# EasyEDA Pro project DS3 CONTROLLER L.epro

# Schematic Schematic1
Create Date: 2026-04-05; Page Name: P1; Project Name: DSBOARD3Daughter; Schematic Name: Schematic1; Update Date: 2026-04-07; Company: EasyEDA.com; Page Size: A4; Version: V1.0
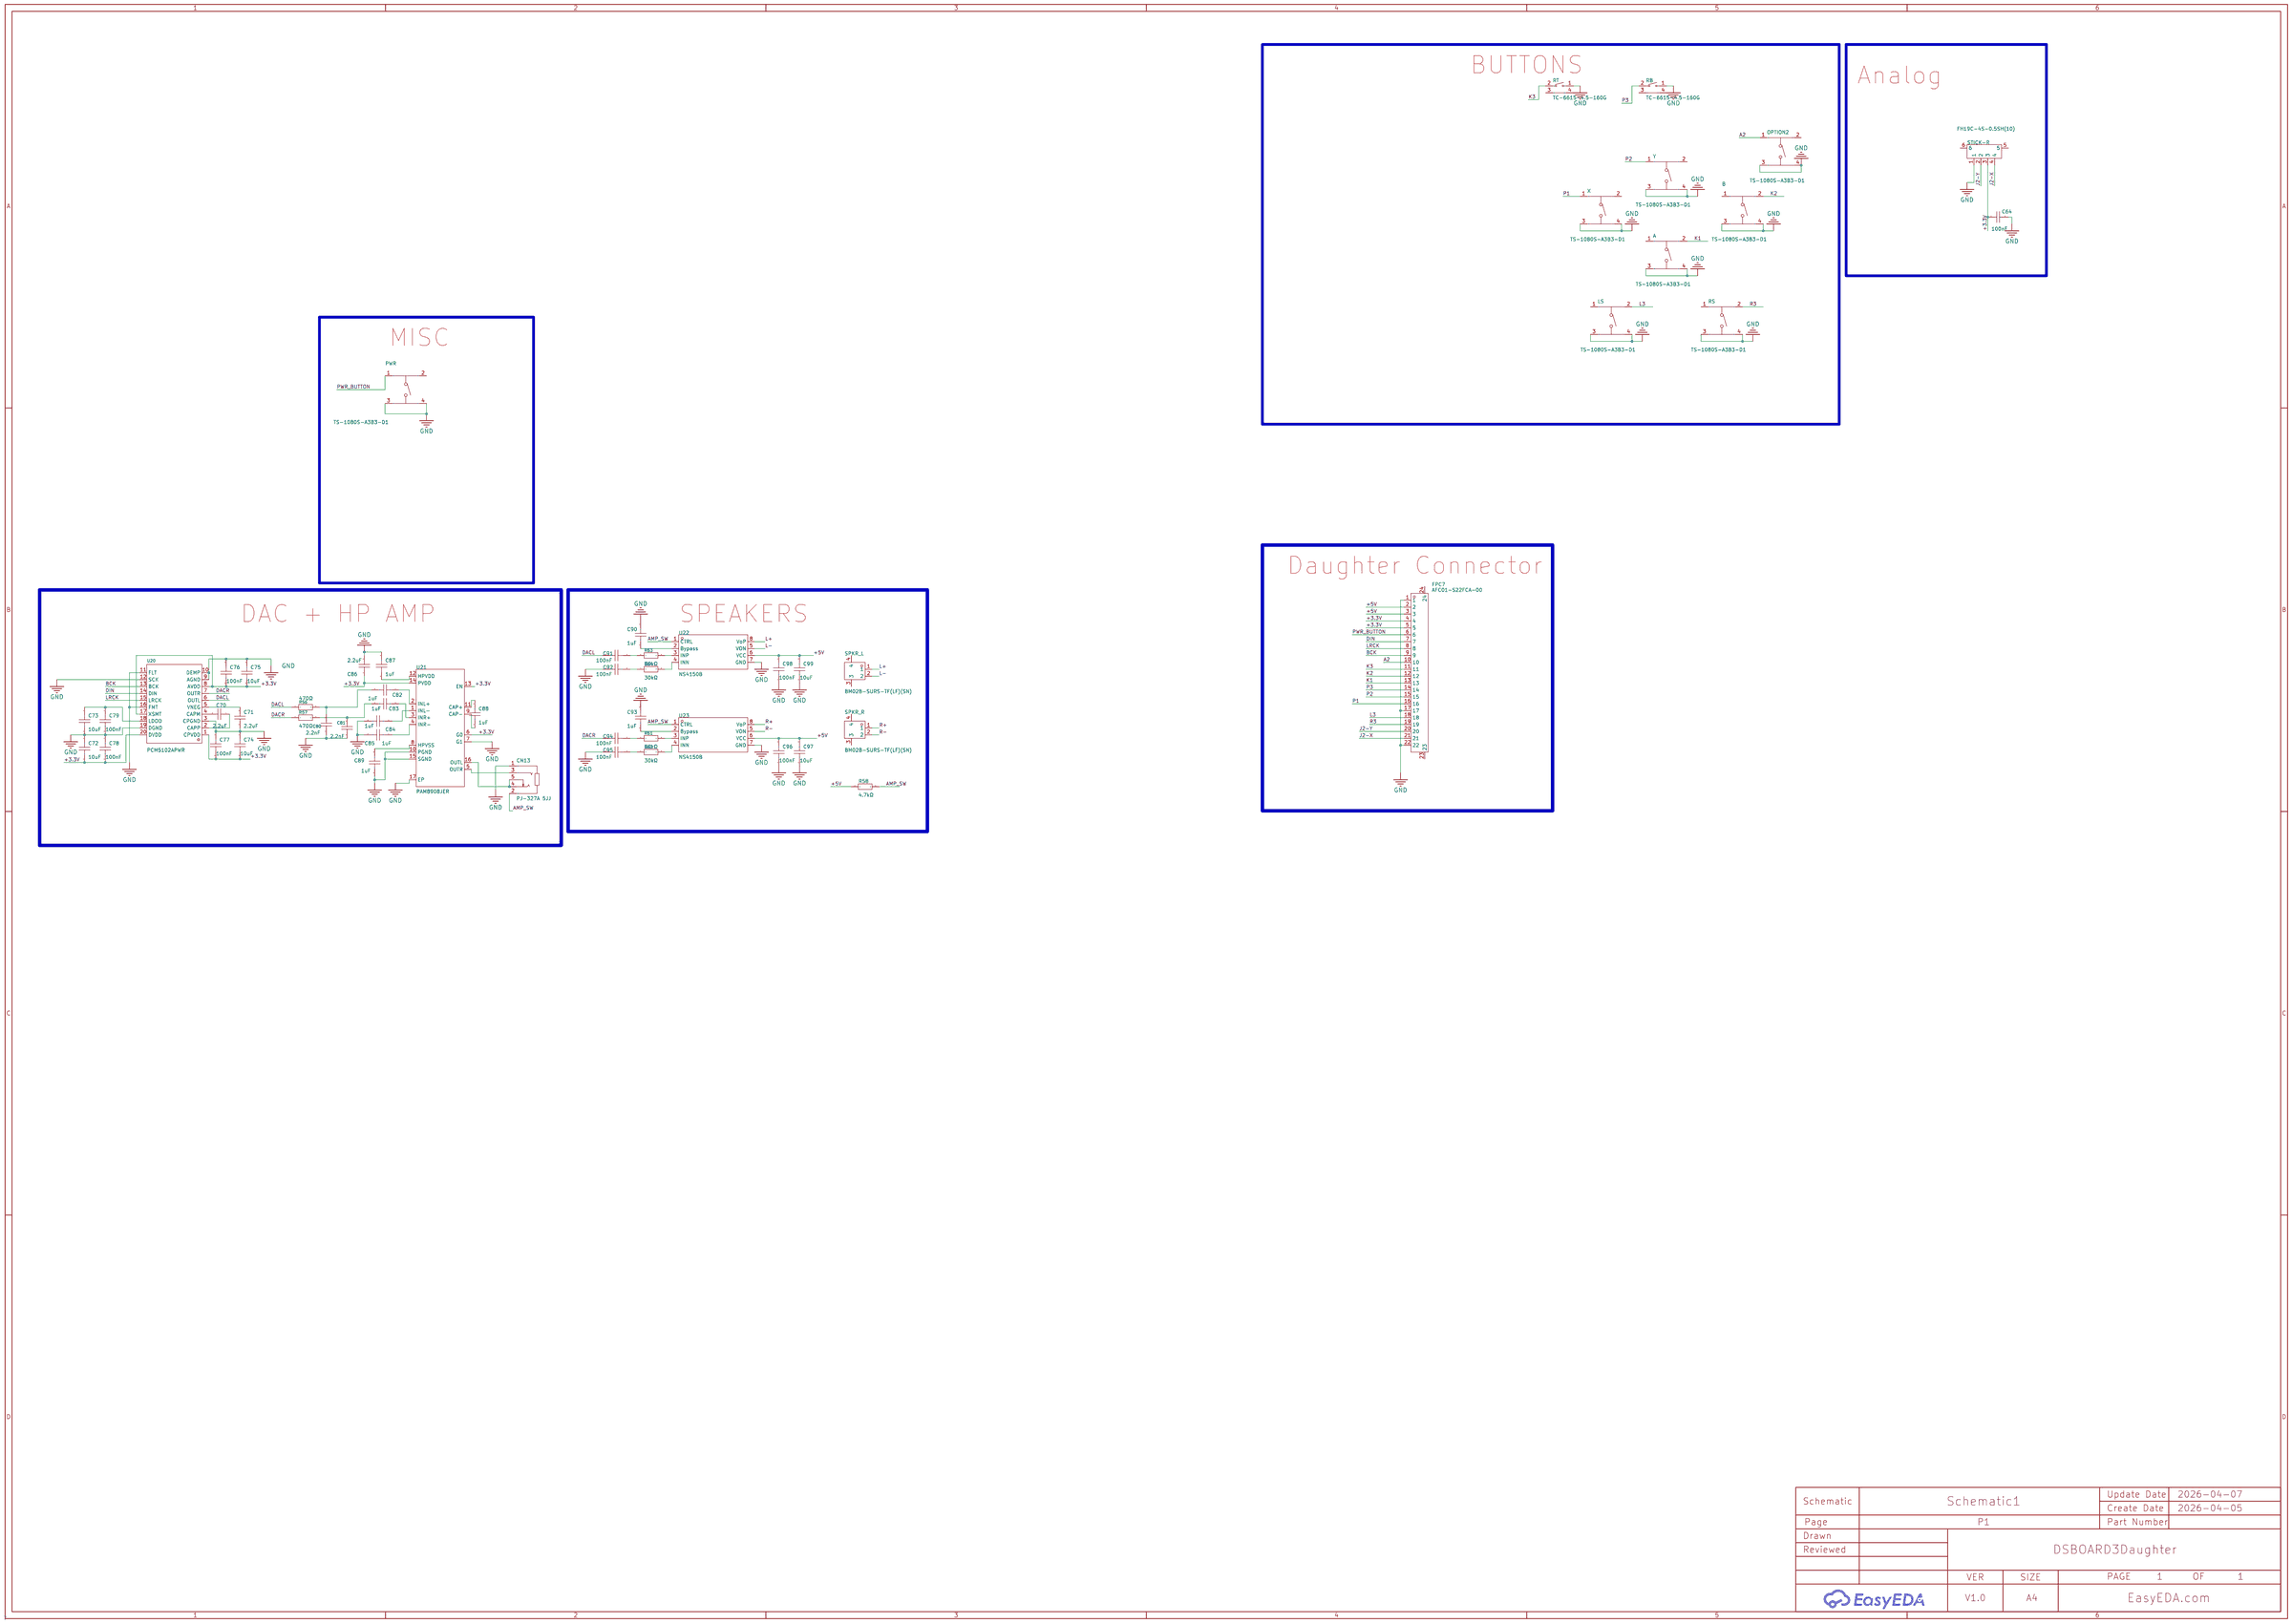
[diagram p0: schematic sheet]

## Parts
A  TS-1080S-A3B3-D1  [KEY-SMD_4P-L6.4-W6.0-P4.50-LS8.4]
B  TS-1080S-A3B3-D1  [KEY-SMD_4P-L6.4-W6.0-P4.50-LS8.4]
C64  100nF  [c0402]
C70  2.2uF  [C0603]
C71  2.2uF  [C0603]
C72  10uF  [C0805]
C73  10uF  [C0805]
C74  10uF  [C0805]
C75  10uF  [C0805]
C76  100nF  [C0603]
C77  100nF  [C0603]
C78  100nF  [C0603]
C79  100nF  [C0603]
C80  2.2nF  [C0805]
C81  2.2nF  [C0805]
C82  1uF  [C0603]
C83  1uF  [C0603]
C84  1uF  [C0603]
C85  1uF  [C0603]
C86  2.2uF  [C0603]
C87  1uF  [C0603]
C88  1uF  [C0603]
C89  1uF  [C0603]
C90  1uF  [C0603]
C91  100nF  [C0402]
C92  100nF  [C0402]
C93  1uF  [C0603]
C94  100nF  [C0402]
C95  100nF  [C0402]
C96  100nF  [C0402]
C97  10uF  [C0805]
C98  100nF  [C0402]
C99  10uF  [C0805]
CN13  PJ-327A 5JJ  [AUDIO-SMD_PJ-327A5JJ]
FPC7  AFC01-S22FCA-00  [FPC-SMD_P0.5-22P_FGS-XJ-H2.0]
LS  TS-1080S-A3B3-D1  [KEY-SMD_4P-L6.4-W6.0-P4.50-LS8.4]
OPTION2  TS-1080S-A3B3-D1  [KEY-SMD_4P-L6.4-W6.0-P4.50-LS8.4]
PWR  TS-1080S-A3B3-D1  [KEY-SMD_4P-L6.4-W6.0-P4.50-LS8.4]
R56  470Ω  [R0805]
R57  470Ω  [R0805]
R58  4.7kΩ  [R0603]
R61  30kΩ  [R0603]
R62  30kΩ  [R0603]
R63  30kΩ  [R0603]
R64  30kΩ  [R0603]
RB  TC-6615-4.5-160G  [KEY-TH_TC-6615-4.5-160G]
RS  TS-1080S-A3B3-D1  [KEY-SMD_4P-L6.4-W6.0-P4.50-LS8.4]
RT  TC-6615-4.5-160G  [KEY-TH_TC-6615-4.5-160G]
SPKR_L  BM02B-SURS-TF(LF)(SN)  [CONN-SMD_2P-P0.80_BM02B-SURS-TF-LF-SN]
SPKR_R  BM02B-SURS-TF(LF)(SN)  [CONN-SMD_2P-P0.80_BM02B-SURS-TF-LF-SN]
STICK-R  FH19C-4S-0.5SH(10)  [FPC-SMD_FH19C-4S-0.5SH]
U20  PCM5102APWR  [TSSOP-20_L6.5-W4.4-P0.65-LS6.4-BL]
U21  PAM8908JER  [QFN-16_L3.0-W3.0-P0.50-BL-EP1.7]
U22  NS4150B  [MSOP-8_L3.0-W3.0-P0.65-LS5.0-BL]
U23  NS4150B  [MSOP-8_L3.0-W3.0-P0.65-LS5.0-BL]
X  TS-1080S-A3B3-D1  [KEY-SMD_4P-L6.4-W6.0-P4.50-LS8.4]
Y  TS-1080S-A3B3-D1  [KEY-SMD_4P-L6.4-W6.0-P4.50-LS8.4]

## Library data of the parts
A B LS OPTION2 PWR RS X Y = TS-1080S-A3B3-D1: Circuit:SPST Actuator Style:Round Button Operating Force:250gf Mounting Type:Standing paste Length:6.4mm Width:6mm Switch Height:3.1mm With Lamp:- Life:-; LCSC Part Name: 停产 6.4*6*3.1mm 立贴 轻触开关; Supplier Part: C499295; Manufacturer: Yuandi(元迪); Supplier Footprint: SMD,6.2x6.2mm; JLCPCB Part Class: Extended Part; Datasheet: https://atta.szlcsc.com/upload/public/pdf/source/20200318/C499299_4F5ACF0CDEE8DE9CCEB2FD2261C6EB2B.pdf; Supplier: LCSC; Circuit: SPST; Actuator Style: Round Button; Operating Force: 250gf; Mounting Type: Standing paste; Length: 6.4mm; Width: 6mm; Switch Height: 3.1mm; Mounting Style: Brick nogging; Switch Length: 6mm; Switch Width: 6mm; Contact Current: 50mA; Voltage Rating (DC): 12V; Insulation Resistance: 100MΩ; Mechanical Life: 10万次; Operating Temperature: -25℃~+85℃
C64 = CL05B104KO5NNNC: Supplier: LCSC; Manufacturer: SAMSUNG(三星); Supplier Part: C1525; JLCPCB Part Class: Basic Part
C70 C71 C86 = CL10A225KO8NNNC: Capacitance: Tolerance:±10% Tolerance:±10% Voltage Rated: Temperature Coefficient:; LCSC Part Name: 2.2uF ±10% 16V; Supplier Part: C23630; Manufacturer: SAMSUNG(三星); Supplier Footprint: 0603; JLCPCB Part Class: Basic Part; Datasheet: https://atta.szlcsc.com/upload/public/pdf/source/20160218/1457707763339.pdf; Supplier: LCSC; Tolerance: ±10%
C72-C75 = GRM21BR61H106KE43L: Capacitance: Tolerance:±10% Tolerance:±10% Voltage Rated: Temperature Coefficient:; LCSC Part Name: 10uF ±10% 50V; Supplier Part: C440198; Manufacturer: muRata(村田); Supplier Footprint: 0805; JLCPCB Part Class: Basic Part; Datasheet: https://atta.szlcsc.com/upload/public/pdf/source/20230811/95AAE0C9AF55EDC31B7A4D8B733F534E.pdf; Supplier: LCSC; Tolerance: ±10%
C76-C79 = CC0603KRX7R9BB104: Capacitance:100nF Tolerance:±10% Tolerance:±10% Voltage Rating:50V Temperature Coefficient:X7R; LCSC Part Name: 100nF ±10% 50V; Supplier Part: C14663; Manufacturer: YAGEO(国巨); Supplier Footprint: 0603; JLCPCB Part Class: Basic Part; Datasheet: https://atta.szlcsc.com/upload/public/pdf/source/20180910/C282072_33301C7F631E79921B82A8DAC6BCC5B3.pdf; Supplier: LCSC; Tolerance: ±10%; Voltage Rating: 50V; Temperature Coefficient: X7R
C80 C81 = CL21C222JBFNNNE: Capacitance: Tolerance:±5% Tolerance:±5% Voltage Rated: Temperature Coefficient:; LCSC Part Name: 2.2nF ±5% 50V; Supplier Part: C28260; Manufacturer: SAMSUNG(三星); Supplier Footprint: 0805; JLCPCB Part Class: Basic Part; Datasheet: https://atta.szlcsc.com/upload/public/pdf/source/20160218/1457707763339.pdf; Supplier: LCSC; Tolerance: ±5%
C82-C85 C87-C90 C93 = CL10A105KB8NNNC: Capacitance: Tolerance:±10% Tolerance:±10% Voltage Rated: Temperature Coefficient:; LCSC Part Name: 1uF ±10% 50V; Supplier Part: C15849; Manufacturer: SAMSUNG(三星); Supplier Footprint: 0603; JLCPCB Part Class: Basic Part; Datasheet: https://atta.szlcsc.com/upload/public/pdf/source/20160218/1457707763339.pdf; Supplier: LCSC; Tolerance: ±10%
C91 C92 C94-C96 C98 = CL05B104KB54PNC: Capacitance: Tolerance:±10% Tolerance:±10% Voltage Rated: Temperature Coefficient:; LCSC Part Name: 100nF ±10% 50V; Supplier Part: C307331; Manufacturer: SAMSUNG(三星); Supplier Footprint: 0402; JLCPCB Part Class: Basic Part; Datasheet: https://atta.szlcsc.com/upload/public/pdf/source/20160218/1457707763339.pdf; Supplier: LCSC; Tolerance: ±10%
C97 C99 = CL21A106KAYNNNE_C15850: Capacitance: Tolerance:±10% Tolerance:±10% Voltage Rated: Temperature Coefficient:; LCSC Part Name: 10uF ±10% 25V; Supplier Part: C15850; Manufacturer: SAMSUNG(三星); Manufacturer Part: CL21A106KAYNNNE; Supplier Footprint: 0805; JLCPCB Part Class: Basic Part; Datasheet: https://atta.szlcsc.com/upload/public/pdf/source/20160218/1457707763339.pdf; Supplier: LCSC; Tolerance: ±10%
CN13 = PJ-327A 5JJ: Connector Type:3.5mm Headphone Jack Current Rating:500mA Voltage Rating (Max):30V Contact Material:- Contact Plating:Gold Operating Temperature:-30℃~+70℃ Operating Temperature:-30℃~+70℃; LCSC Part Name: 3.5mm耳机座; Supplier Part: C668605; Manufacturer: SHOU HAN(首韩); Supplier Footprint: SMD; JLCPCB Part Class: Extended Part; Datasheet: https://item.szlcsc.com/datasheet/PJ-327A%25205JJ/698548.html; Supplier: LCSC; Connector Type: 3.5mm Headphone Jack; Current Rating: 500mA; Voltage Rating (Max): 30V; Contact Plating: Gold; Operating Temperature: -30℃~+70℃
FPC7 = AFC01-S22FCA-00: Locking Feature:Clamshell Contact Type:Bottom Contact Number of Contacts:22P Pitch:0.5mm Mounting Type:卧贴 FFC, FCB Thickness:0.3mm FFC, FCB Thickness:0.3mm Height Above Board:2mm; LCSC Part Name: 间距:0.5mm P数:22P 翻盖式 下接; Supplier Part: C262668; Manufacturer: JS(钜硕电子); Supplier Footprint: SMD,P=0.5mm,卧贴; JLCPCB Part Class: Extended Part; Datasheet: https://atta.szlcsc.com/upload/public/pdf/source/20190816/C413942_2A72D1AC756EAE17EEDF756A339D4500.pdf; Supplier: LCSC; Locking Feature: Clamshell; Contact Type: Bottom Contact; Number of Contacts: 22P; Pitch: 0.5mm; Mounting Type: 卧贴; FFC, FCB Thickness: 0.3mm; Height Above Board: 2mm
R56 R57 = 0805W8F4700T5E: Type:Thick Film Resistors Resistance: Tolerance:±1% Tolerance:±1% Power(Watts): Overload Voltage (Max): Temperature Coefficient:±100ppm/℃ Temperature Coefficient:±100ppm/℃ Operating Temperature Range:-55℃~+155℃ Operating Temperature Range:-55℃~+155℃; LCSC Part Name: 470Ω ±1% 125mW 厚膜电阻; Supplier Part: C17710; Manufacturer: UNI-ROYAL(厚声); Supplier Footprint: 0805; JLCPCB Part Class: Basic Part; Datasheet: https://atta.szlcsc.com/upload/public/pdf/source/20200306/C422600_1E6D84923E4A46A82E41ADD87F860B5C.pdf; Supplier: LCSC; Type: Thick Film Resistors; Tolerance: ±1%; Temperature Coefficient: ±100ppm/℃; Operating Temperature Range: -55℃~+155℃
R58 = 0603WAF4701T5E: Type:Thick Film Resistor Resistance:4.7kΩ Tolerance:±1% Tolerance:±1% Power(Watts):100mW Voltage-Supply(Max):75V Temperature Coefficient:±100ppm/℃ Temperature Coefficient:±100ppm/℃ Operating Temperature:-55℃~+155℃ Operating Temperature:-55℃~+155℃; LCSC Part Name: 4.7kΩ ±1% 100mW 厚膜电阻; Supplier Part: C23162; Manufacturer: UNI-ROYAL(厚声); Supplier Footprint: 0603; JLCPCB Part Class: Basic Part; Datasheet: https://item.szlcsc.com/datasheet/0603WAF4701T5E/23889.html; Supplier: LCSC; Type: Thick Film Resistor; Tolerance: ±1%; Power(Watts): 100mW; Voltage-Supply(Max): 75V; Temperature Coefficient: ±100ppm/℃; Operating Temperature: -55℃~+155℃
R61-R64 = 0603WAF3002T5E: Type:Thick Film Resistor Resistance:30kΩ Tolerance:±1% Tolerance:±1% Power(Watts):100mW Voltage-Supply(Max):75V Temperature Coefficient:±100ppm/℃ Temperature Coefficient:±100ppm/℃ Operating Temperature:-55℃~+155℃ Operating Temperature:-55℃~+155℃; LCSC Part Name: 30kΩ ±1% 100mW 厚膜电阻; Supplier Part: C22984; Manufacturer: UNI-ROYAL(厚声); Supplier Footprint: 0603; JLCPCB Part Class: Basic Part; Datasheet: https://item.szlcsc.com/datasheet/0603WAF3002T5E/23711.html; Supplier: LCSC; Type: Thick Film Resistor; Tolerance: ±1%; Power(Watts): 100mW; Voltage-Supply(Max): 75V; Temperature Coefficient: ±100ppm/℃; Operating Temperature: -55℃~+155℃
RB RT = TC-6615-4.5-160G: Circuit:SPST Actuator Style:Round Button Operating Force:160gf Mounting Style:Horizontal Plug Switch Length:6mm Switch Width:6mm Switch Height:4.5mm Strike Gundam:With bracket Contact Current:50mA Voltage Rating (AC):- Voltage Rating (DC):12V Insulation R; LCSC Part Name: 6*6*4.5mm 卧插 轻触开关; Supplier Part: C6575012; Manufacturer: HCTL(华灿天禄); Supplier Footprint: 插件; JLCPCB Part Class: Extended Part; Datasheet: https://atta.szlcsc.com/upload/public/pdf/source/20230523/20C79B748B4ACB531A66068A8A6BD305.pdf; Supplier: LCSC; Circuit: SPST; Actuator Style: Round Button; Operating Force: 160gf; Mounting Style: Horizontal Plug; Switch Length: 6mm; Switch Width: 6mm; Switch Height: 4.5mm; Strike Gundam: With bracket; Contact Current: 50mA; Voltage Rating (DC): 12V; Insulation Resistance: 100MΩ; Actuator/Cap Color: Black; With Lamp: None; Mechanical Life: 100000 Times; Operating Temperature: -25℃~+85℃
SPKR_L SPKR_R = BM02B-SURS-TF(LF)(SN): Pins Structure:1x2P Pitch:0.8mm Mounting Style:Vertical welding Reference Series:SUR Number of Pins:2P Number of Rows:1 Number of PINs Per Row:2 Row Spacing:- Current Rating (Max):500mA Contact Material:Copper Alloy Contact Plating:Tin Operating Temperatu; LCSC Part Name: 1x2P 间距:0.8mm 立贴 系列:SUR; Supplier Part: C385130; Manufacturer: JST; Supplier Footprint: SMD,P=0.8mm; JLCPCB Part Class: Extended Part; Datasheet: https://atta.szlcsc.com/upload/public/pdf/source/20200311/C495545_E72935403D1EB49F793AD89C21E66448.pdf; Supplier: LCSC; Pins Structure: 1x2P; Pitch: 0.8mm; Mounting Style: Vertical welding; Reference Series: SUR; Number of Pins: 2P; Number of Rows: 1; Number of PINs Per Row: 2; Current Rating (Max): 500mA; Contact Material: Copper Alloy; Contact Plating: Tin; Operating Temperature Range: -25℃~+85℃; Rated Voltage (Max): 30V; Plastic Material: PA; Flame Retardant Rating: UL94V-0; Supplementary Features: 辅助焊脚; Colour: White; Z-Height of the Board: 2.7mm; X-Length of Bottom Edge on Board (Spacing Line): 3.8mm; Y-Width of Bottom Edge on Board: 2mm
STICK-R = FH19C-4S-0.5SH(10): Locking Feature:Clamshell Contact Type:Bottom Contact Number of Contacts:4P Pitch:0.5mm Mounting Type:卧贴 FFC, FCB Thickness:0.2mm FFC, FCB Thickness:0.2mm Height Above Board:0.88mm Contact Material:Phosphor bronze Contact Plating:Gold Operating Temperatur; LCSC Part Name: 间距:0.5mm P数:4P 翻盖式 下接; Supplier Part: C424650; Manufacturer: HRS(广濑); Supplier Footprint: SMD,P=0.5mm,卧贴; JLCPCB Part Class: Extended Part; Datasheet: https://atta.szlcsc.com/upload/public/pdf/source/20190903/C424652_96088C35DDF9B9746B51C85A1732CDEC.pdf; Supplier: LCSC; Locking Feature: Clamshell; Contact Type: Bottom Contact; Number of Contacts: 4P; Pitch: 0.5mm; Mounting Type: 卧贴; FFC, FCB Thickness: 0.2mm; Height Above Board: 0.88mm; Contact Material: Phosphor bronze; Contact Plating: Gold; Operating Temperature Range: -55℃~+85℃
U20 = PCM5102APWR: Interface Type:PCM Supply Voltage:1.65V~3.46V Supply Voltage:1.65V~3.46V Number of Channels:2 Resolution:24；16；32 Operating Temperature:-25℃~+85℃ Operating Temperature:-25℃~+85℃; Supplier Part: C107671; Manufacturer: TI(德州仪器); Supplier Footprint: TSSOP-20; JLCPCB Part Class: Extended Part; Datasheet: https://www.ti.com/cn/lit/gpn/pcm5102a; Supplier: LCSC; Interface Type: PCM; Supply Voltage: 1.65V~3.46V; Number of Channels: 2; Resolution: 24；16；32; Operating Temperature: -25℃~+85℃
U21 = PAM8908JER: Class:AB Class Amplifier Speaker Channels:Dual Channel Output Power:35mWx2@16Ω Voltage - Supply:2.5V~5.5V Voltage - Supply:2.5V~5.5V; LCSC Part Name: 35mW立体声AB类音频功率放大器; Supplier Part: C33233; Manufacturer: DIODES(美台); Supplier Footprint: QFN-16-EP(3x3); JLCPCB Part Class: Extended Part; Datasheet: https://atta.szlcsc.com/upload/public/pdf/source/20241225/198AA8C4DF618023934B9402F7273380.pdf; Supplier: LCSC; Class: AB Class Amplifier; Speaker Channels: Dual Channel; Output Power: 35mWx2@16Ω; Voltage - Supply: 2.5V~5.5V
U22 U23 = NS4150B_C189961: Class:Class D Output Power:3Wx1@4Ω Voltage - Supply:3V~5.25V Voltage - Supply:3V~5.25V; Supplier Part: C189961; Manufacturer: Nsiway(纳芯威); Supplier Footprint: MSOP-8; JLCPCB Part Class: Extended Part; Datasheet: https://item.szlcsc.com/datasheet/NS4150B/207582.html; Supplier: LCSC; Class: Class D; Output Power: 3Wx1@4Ω; Voltage - Supply: 3V~5.25V

## Nets
+3.3V: C64.1 C72.2 C74.2 C75.2 C76.2 C77.2 C78.2 C86.1 FPC7.4 FPC7.5 STICK-R.3 U20.1(CPVDD) U20.8(AVDD) U20.17(XSMT) U20.20(DVDD) U21.6(G0) U21.13(EN) U21.14(PVDD)
+5V: C96.2 C97.2 C98.2 C99.2 FPC7.2 FPC7.3 R58.1 U22.6(VCC) U23.6(VCC)
GND: A.3 A.4 B.3 B.4 C64.2 C71.1 C72.1 C73.2 C74.1 C75.1 C76.1 C77.1 C78.1 C79.2 C80.2 C81.2 C84.2 C85.2 C86.2 C87.2 C89.1 C90.2 C92.1 C93.2 C95.1 C96.1 C97.1 C98.1 C99.1 CN13.1 FPC7.1 FPC7.17 FPC7.22 LS.3 LS.4 OPTION2.3 OPTION2.4 PWR.3 PWR.4 RB.1 RS.3 RS.4 RT.1 STICK-R.1 U20.3(CPGND) U20.9(AGND) U20.10(DEMP) U20.11(FLT) U20.12(SCK) U20.16(FMT) U20.19(DGND) U21.7(G1) U21.10(PGND) U21.15(SGND) U21.17(EP) U22.7(GND) U23.7(GND) X.3 X.4 Y.3 Y.4
A2: FPC7.10 OPTION2.1
AMP_SW: CN13.2 R58.2 U22.1(CTRL) U23.1(CTRL)
BCK: FPC7.9 U20.13(BCK)
DACL: C91.1 R56.1 U20.6(OUTL)
DACR: C94.1 R57.1 U20.7(OUTR)
DIN: FPC7.7 U20.14(DIN)
J2-X: FPC7.21 STICK-R.4
J2-Y: FPC7.20 STICK-R.2
K1: A.2 FPC7.13
K2: B.2 FPC7.12
K3: FPC7.11 RT.2
L3: FPC7.18 LS.2
L+: SPKR_L.1 U22.8(VoP)
L-: SPKR_L.2 U22.5(VON)
LRCK: FPC7.8 U20.15(LRCK)
P1: FPC7.16 X.1
P2: FPC7.15 Y.1
P3: FPC7.14 RB.2
PWR_BUTTON: FPC7.6 PWR.1
R3: FPC7.19 RS.2
R+: SPKR_R.1 U23.8(VoP)
R-: SPKR_R.2 U23.5(VON)
$1N5344: C70.2 U20.4(CAPM)
$1N5349: C70.1 U20.2(CAPP)
$1N5350: C71.2 U20.5(VNEG)
$1N5352: C73.1 C79.1 U20.18(LDOO)
$1N5360: C81.1 C83.2 R57.2
$1N5361: C80.1 C82.2 R56.2
$1N5362: C82.1 U21.2(INL+)
$1N5365: C85.1 U21.4(INR-)
$1N5368: C87.1 U21.12(HPVDD)
$1N5369: C88.2 U21.11(CAP+)
$1N5370: C88.1 U21.9(CAP-)
$1N5382: C89.2 U21.8(HPVSS)
$1N9109: CN13.3 U21.5(OUTR)
$1N9136: CN13.4 CN13.5 U21.16(OUTL)
$1N24333: C83.1 U21.3(INR+)
$1N24340: C84.1 U21.1(INL-)
$1N24601: C90.1 U22.2(Bypass)
$1N24795: C91.2 R63.1
$1N24871: C92.2 R64.1
$1N24873: R63.2 U22.3(INP)
$1N24877: R64.2 U22.4(INN)
$1N24927: C93.1 U23.2(Bypass)
$1N25083: R62.2 U23.4(INN)
$1N25086: R61.2 U23.3(INP)
$1N25088: C95.2 R62.1
$1N25090: C94.2 R61.1

Not connected (* = marked no-connect by the designer): A 1; B 1; FPC7 23 24; LS 1; OPTION2 2; PWR 2; RB 3 4; RS 1; RT 3 4; SPKR_L 3 4; SPKR_R 3 4; STICK-R 5 6; X 2; Y 2

## Notes on the sheet
- BUTTONS
- Analog
- MISC
- Daughter Connector
- DAC + HP AMP
- SPEAKERS

# Board PCB1
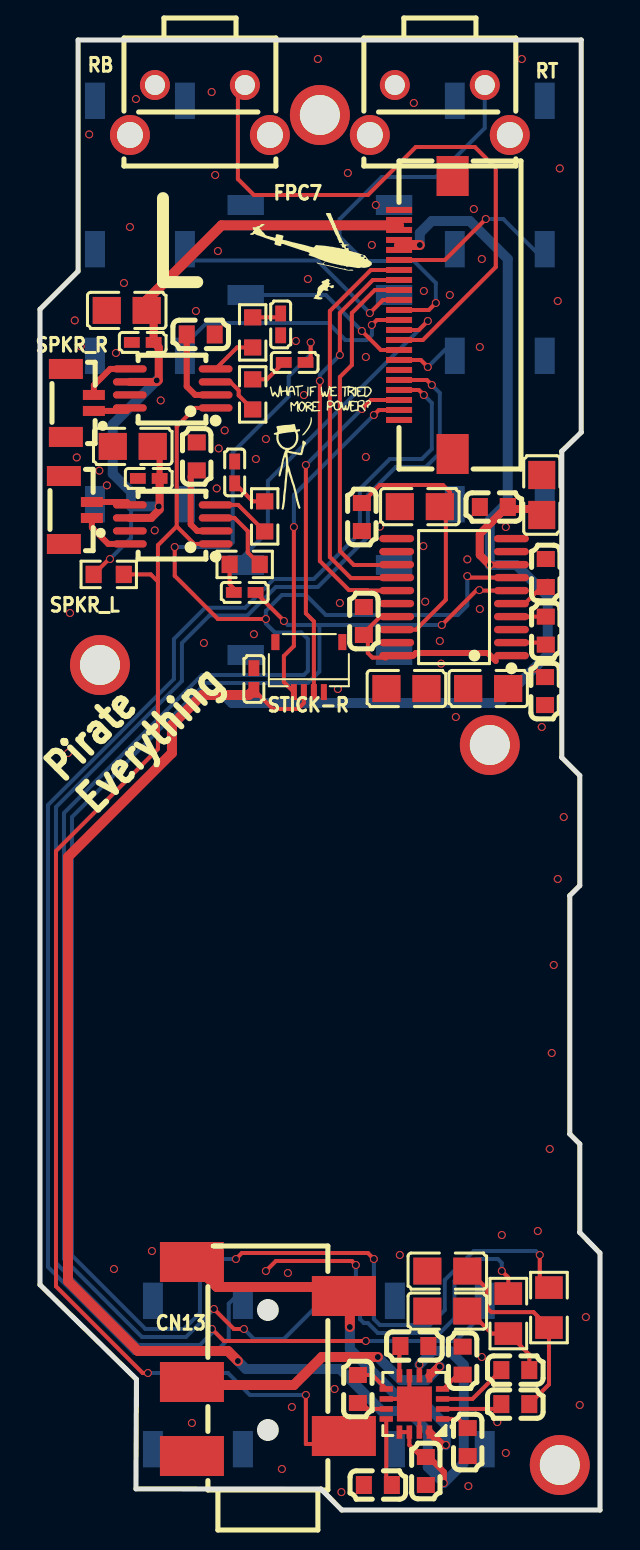
[diagram p1: board, top side]
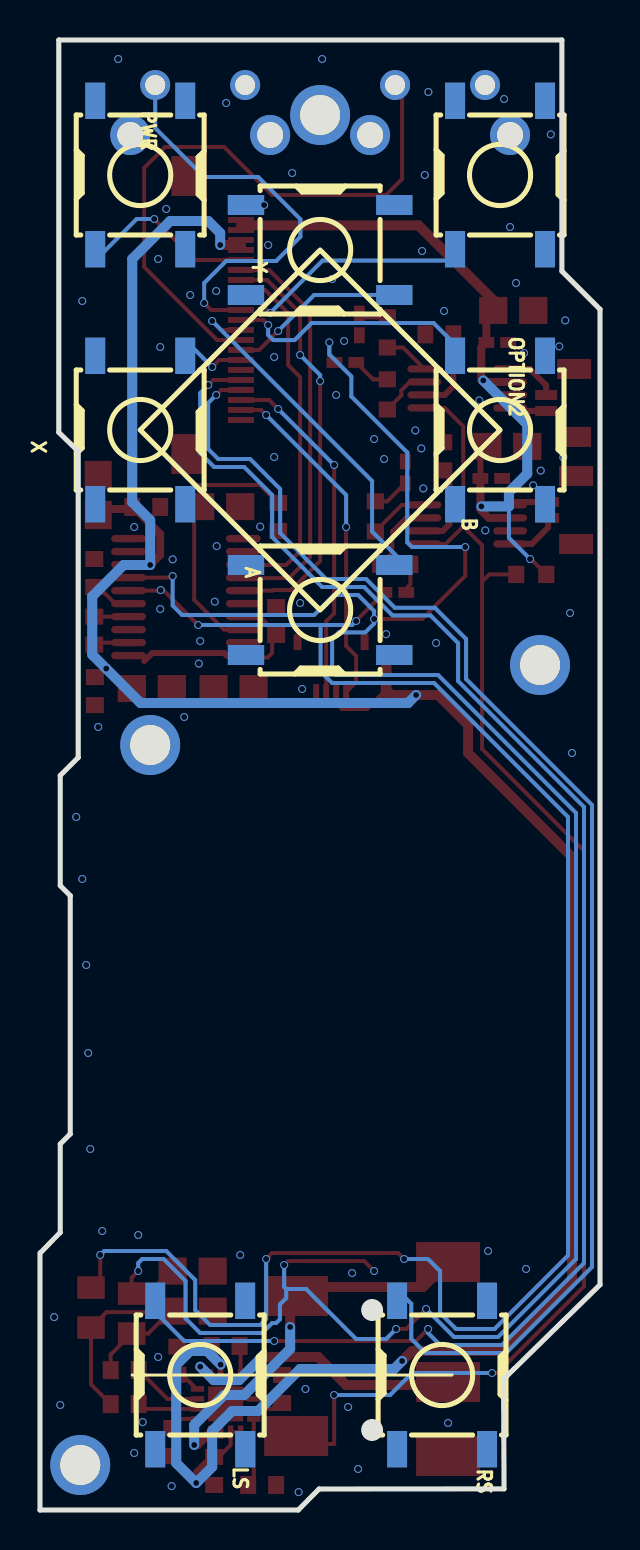
[diagram p2: board, bottom side, seen from below]

Outline 28.01 x 73.5 mm; copper layers: Top Layer, Inner1, Inner2, Bottom Layer. Coordinates in mm from the lower left corner of the outline.
Outline path: 28,12.85 27,13.88 27,18.3 26.5,18.8 26.5,30.72 27,31.22 27,36.72 26.1,37.62 26.1,52.94 27.07,53.88 27.07,73.5 1.91,73.5 1.91,61.94 0,60.03 0,11.26 4.83,6.54 4.8,1.06 14.06,1.05 15.09,0 28.01,0 28.01,12.85
Stack: Top Layer 0.035mm 外层铜厚1oz / Dielectric1 0.2104mm 7628 RC49% 8.6mil / Inner1 0.0152mm 内层铜厚 / Dielectric2 1.065mm 1.1mm H/HOZ 含铜 / Inner2 0.0152mm 内层铜厚 / Dielectric3 0.2104mm 7628 RC49% 8.6mil / Bottom Layer 0.035mm 外层铜厚1oz

## Design rules (mm)
template: Custom Config
spacing copperThickness1oz (default): track to track 0.102, other pairs 0.152 to 0.3
spacing copperThickness2oz: track to track 0.203, other pairs 0.152 to 0.3
track width copperThickness1oz (default): min 0.127, default 0.254, max 2.54
track width copperThickness2oz: min 0.203, default 0.254, max 2.54
differential pair differentialPair (default): width min 0.127, default 0.254, max 2.54; gap min 0.152, default 0.152
differential pair USB2: width min 0.239, default 0.239, max 0.239; gap min 0.15, default 0.15
via viaSize (default): diameter min 0.3, default 0.61, max 10; hole min 0.2, default 0.305, max 6.3
pour e1096 uses copperRegion1
pour e1109 uses copperRegion1
pour e3081 uses copperRegion1
pour e3047 uses copperRegion1
pour e2858 uses copperRegion1
pour e2727 uses copperRegion1

## Placement (name value [footprint] x y rotation side)
A  TS-1080S-A3B3-D1  [KEY-SMD_4P-L6.4-W6.0-P4.50-LS8.4]  14 45 180 bottom
B  TS-1080S-A3B3-D1  [KEY-SMD_4P-L6.4-W6.0-P4.50-LS8.4]  5 54 90 bottom
C64  100nF  [c0402]  10.7 41.55 90 top
C70  2.2uF  [C0603]  25.3 43.97 90 top
C71  2.2uF  [C0603]  25.3 46.85 270 top
C72  10uF  [C0805]  22.42 41.07 0 top
C73  10uF  [C0805]  19 50.17 180 top
C74  10uF  [C0805]  25.1 50.75 270 top
C75  10uF  [C0805]  18.33 41.07 180 top
C76  100nF  [C0603]  16.2 44.45 270 top
C77  100nF  [C0603]  22.7 50.15 0 top
C78  100nF  [C0603]  25.27 40.95 90 top
C79  100nF  [C0603]  16.1 49.65 270 top
C80  2.2nF  [C0805]  20.38 11.95 180 top
C81  2.2nF  [C0805]  20.38 9.95 180 top
C82  1uF  [C0603]  23.78 5.29 0 top
C83  1uF  [C0603]  23.78 7 0 top
C84  1uF  [C0603]  21.4 3.4 270 top
C85  1uF  [C0603]  21.14 7.47 90 top
C86  2.2uF  [C0603]  19.3 1.95 270 top
C87  1uF  [C0603]  16.9 1.25 180 top
C88  1uF  [C0603]  15.9 6.05 270 top
C89  1uF  [C0603]  18.73 8.2 180 top
C90  1uF  [C0603]  7.84 52.68 90 top
C91  100nF  [C0402]  10.24 45.88 180 top
C92  100nF  [C0402]  9.74 51.88 270 top
C93  1uF  [C0603]  8.04 58.78 0 top
C94  100nF  [C0402]  12.74 57.38 180 top
C95  100nF  [C0402]  12.04 59.28 90 top
C96  100nF  [C0402]  5.14 58.38 0 top
C97  10uF  [C0805]  4.34 59.98 0 top
C98  100nF  [C0402]  5.44 51.58 0 top
C99  10uF  [C0805]  4.64 53.18 0 top
CN13  PJ-327A 5JJ  [AUDIO-SMD_PJ-327A5JJ]  11.4 7.55 180 top
FPC7  AFC01-S22FCA-00  [FPC-SMD_P0.5-22P_FGS-XJ-H2.0]  19.3 59.75 270 top
LS  TS-1080S-A3B3-D1  [KEY-SMD_4P-L6.4-W6.0-P4.50-LS8.4]  20 6.75 90 bottom
NOREF  -  [Pad_e2703]  14 69.75 90 top
NOREF#2  -  [Pad_e10200]  22.5 38.25 90 top
NOREF#3  -  [Pad_e2702]  3 42.25 90 top
NOREF#4  -  [Pad_e2701]  26 2.25 90 top
OPTION2  TS-1080S-A3B3-D1  [KEY-SMD_4P-L6.4-W6.0-P4.50-LS8.4]  5 66.75 90 bottom
PWR  TS-1080S-A3B3-D1  [KEY-SMD_4P-L6.4-W6.0-P4.50-LS8.4]  23 66.75 90 bottom
R56  470Ω  [R0805]  25.46 10.12 270 top
R57  470Ω  [R0805]  23.43 9.82 270 top
R58  4.7kΩ  [R0603]  3.44 46.78 0 top
R61  30kΩ  [R0603]  10.64 55.78 270 top
R62  30kΩ  [R0603]  10.64 58.88 270 top
R63  30kΩ  [R0603]  10.24 47.28 0 top
R64  30kΩ  [R0603]  11.24 49.68 270 top
RB  TC-6615-4.5-160G  [KEY-TH_TC-6615-4.5-160G]  8 70 180 top
RS  TS-1080S-A3B3-D1  [KEY-SMD_4P-L6.4-W6.0-P4.50-LS8.4]  7.9 6.75 90 bottom
RT  TC-6615-4.5-160G  [KEY-TH_TC-6615-4.5-160G]  20 70 180 top
SPKR_L  BM02B-SURS-TF(LF)(SN)  [CONN-SMD_2P-P0.80_BM02B-SURS-TF-LF-SN]  1.9 50 270 top
SPKR_R  BM02B-SURS-TF(LF)(SN)  [CONN-SMD_2P-P0.80_BM02B-SURS-TF-LF-SN]  2 55.35 270 top
STICK-R  FH19C-4S-0.5SH(10)  [FPC-SMD_FH19C-4S-0.5SH]  13.45 42.15 180 top
U20  PCM5102APWR  [TSSOP-20_L6.5-W4.4-P0.65-LS6.4-BL]  20.71 45.65 90 top
U21  PAM8908JER  [QFN-16_L3.0-W3.0-P0.50-BL-EP1.7]  18.73 5.3 90 top
U22  NS4150B  [MSOP-8_L3.0-W3.0-P0.65-LS5.0-BL]  6.64 49.28 90 top
U23  NS4150B  [MSOP-8_L3.0-W3.0-P0.65-LS5.0-BL]  6.64 56.08 90 top
X  TS-1080S-A3B3-D1  [KEY-SMD_4P-L6.4-W6.0-P4.50-LS8.4]  23 54 270 bottom
Y  TS-1080S-A3B3-D1  [KEY-SMD_4P-L6.4-W6.0-P4.50-LS8.4]  14 63 0 bottom

## Footprints (pads in the part's own frame, mm; a bottom-side part is the same pattern mirrored in y, then rotated)
AUDIO-SMD_PJ-327A5JJ
  rect 3.2x2 smd: 1(3.8,4.85) 2(-3.8,3.85) 3(3.8,1.15) 4(-3.8,-3.15) 5(3.8,-4.85)
c0402
  rect 0.79x0.54 smd: 1(-0.545,0) 2(0.545,0)
C0402
  rect 0.79x0.54 smd: 1(-0.545,0) 2(0.545,0)
C0603
  rect 0.8x0.9 smd: 1(-0.7,0) 2(0.7,0)
C0805
  rect 1.41x1.35 smd: 1(-1,0) 2(1,0)
CONN-SMD_2P-P0.80_BM02B-SURS-TF-LF-SN
  rect 0.5x1.1 smd: 1(0.4,0.7) 2(-0.4,0.7)
  rect 1x1.7 smd: 3(-1.7,-0.7) 4(1.7,-0.7)
FPC-SMD_FH19C-4S-0.5SH
  rect 0.3x0.8 smd: 1(-0.75,1.25) 2(-0.25,1.25) 3(0.25,1.25) 4(0.75,1.25)
  rect 0.4x0.8 smd: 5(1.675,-1.25) 6(-1.675,-1.25)
FPC-SMD_P0.5-22P_FGS-XJ-H2.0
  rect 0.3x1.3 smd: 1(-5.252,-1.338) 2(-4.752,-1.338) 3(-4.252,-1.338) 4(-3.752,-1.338) 5(-3.252,-1.338) 6(-2.752,-1.338) 7(-2.252,-1.338) 8(-1.752,-1.338) 9(-1.25,-1.339) 10(-0.752,-1.338) 11(-0.252,-1.338) 12(0.248,-1.338) 13(0.748,-1.338) 14(1.248,-1.338) 15(1.748,-1.338) 16(2.248,-1.338) 17(2.748,-1.338) 18(3.248,-1.338) 19(3.748,-1.338) 20(4.25,-1.339) 21(4.748,-1.338) 22(5.248,-1.338)
  rect 2x1.6 smd: 23(6.95,1.339) 24(-6.95,1.339)
KEY-SMD_4P-L6.4-W6.0-P4.50-LS8.4
  rect 1.82x1 smd: 1(-3.71,2.25) 2(3.71,2.25) 3(-3.71,-2.25) 4(3.71,-2.25)
KEY-TH_TC-6615-4.5-160G
  round 1.5 hole 1: 1(2.25,-1.25) 2(-2.25,-1.25)
  round 2 hole 1.3: 3(-3.5,1.25) 4(3.5,1.25)
MSOP-8_L3.0-W3.0-P0.65-LS5.0-BL
  oval 0.364x1.692 smd: 1(-0.975,-2.146) 2(-0.325,-2.146) 3(0.325,-2.146) 4(0.975,-2.146) 5(0.975,2.146) 6(0.325,2.146) 7(-0.325,2.146) 8(-0.975,2.146)
Pad_e2701
  round 3 hole 2: 5(0,0)
Pad_e2702
  round 3 hole 2: 6(0,0)
Pad_e2703
  round 3 hole 2: 7(0,0)
Pad_e10200
  round 3 hole 2: 6(0,0)
QFN-16_L3.0-W3.0-P0.50-BL-EP1.7
  rect 0.28x0.665 smd: 1(-0.75,-1.407) 2(-0.25,-1.407) 3(0.25,-1.407) 4(0.75,-1.407) 9(0.75,1.407) 10(0.25,1.407) 11(-0.25,1.407) 12(-0.75,1.407)
  rect 0.665x0.28 smd: 5(1.407,-0.75) 6(1.407,-0.25) 7(1.407,0.25) 8(1.407,0.75) 13(-1.407,0.75) 14(-1.407,0.25) 15(-1.407,-0.25) 16(-1.407,-0.75)
  rect 1.75x1.75 smd: 17(0,0)
R0603
  rect 0.806x0.864 smd: 1(-0.753,0) 2(0.753,0)
R0805
  rect 1.133x1.377 smd: 1(-1,0) 2(1,0)
TSSOP-20_L6.5-W4.4-P0.65-LS6.4-BL
  oval 0.364x1.742 smd: 1(-2.925,-2.871) 2(-2.275,-2.871) 3(-1.625,-2.871) 4(-0.975,-2.871) 5(-0.325,-2.871) 6(0.325,-2.871) 7(0.975,-2.871) 8(1.625,-2.871) 9(2.275,-2.871) 10(2.925,-2.871) 11(2.925,2.871) 12(2.275,2.871) 13(1.625,2.871) 14(0.975,2.871) 15(0.325,2.871) 16(-0.325,2.871) 17(-0.975,2.871) 18(-1.625,2.871) 19(-2.275,2.871) 20(-2.925,2.871)

## Nets
As in the schematic, except:
GND: A.3 A.4 B.3 B.4 C64.2 C71.1 C72.1 C73.2 C74.1 C75.1 C76.1 C77.1 C78.1 C79.2 C80.2 C81.2 C84.2 C85.2 C86.2 C87.2 C89.1 C90.2 C92.1 C93.2 C95.1 C96.1 C97.1 C98.1 C99.1 CN13.1 FPC7.1 FPC7.17 FPC7.22 LS.3 LS.4 NOREF.7 NOREF#2.6 NOREF#3.6 NOREF#4.5 OPTION2.3 OPTION2.4 PWR.3 PWR.4 RB.1 RS.3 RS.4 RT.1 STICK-R.1 U20.3 U20.9 U20.10 U20.11 U20.12 U20.16 U20.19 U21.7 U21.10 U21.15 U21.17 U22.7 U23.7 X.3 X.4 Y.3 Y.4

Pads without a net: A 1; B 1; FPC7 23 24; LS 1; OPTION2 2; PWR 2; RB 3 4; RS 1; RT 3 4; SPKR_L 3 4; SPKR_R 3 4; STICK-R 5 6; X 2; Y 2

## Via types
v1: diameter 0.4, hole 0.3, Top Layer to Bottom Layer, 125 vias

## Routing (per net, layer and track width the routed paths; a pad name or vN(x,y) marks a point on that pad's centre or on a via; arc(x,y) is an arc through that point)
+3.3V: length 139.7
  Top Layer w0.2: FPC7.5 FPC7.4 ; 17.37,42.62 16.63,42.62 16.4,42.85 16.4,43.45 16.1,43.75 17.02,44.67 U20.17 ; STICK-R.3 13.2,40.35 12.9,40.05 11.65,40.05 C64.1 ; U21.6 v1(18.98,7.27) ; U21.13 U21.14 18.48,3.25 19.04,2.69 19,2.65
  Top Layer w0.3: 17.27,42.62 17.37,42.72 U20.20 18.67,42.72 18.8,42.85 22.4,42.85 22.8,42.45 ; v1(20.2,1.35) 20.2,1.9 19.45,2.65 C86.1 ; 23.58,47.27 22.52,47.27 v1(22.5,47.25)
  Top Layer w0.4: 25.3,49.75 25,50.05 23.25,50.05 22,48.8 22,47.75 v1(22.5,47.25)
  Top Layer w0.5: v1(19,63.25) 17.98,63.25 17.96,63.23 ; C64.1 10.44,40.75 v1(9.2,40.75) 8.1,40.75 6.6,39.25 6.6,37.85 1.4,32.65 1.4,11.45 4.9,7.95 9.4,7.95 v1(9.9,7.45)
  Bottom Layer w0.5: v1(9.9,7.45) 10.3,7.05 15,7.05 17.1,4.95 18.4,4.95 19.4,3.95 19.4,2.15 v1(20.2,1.35) 21.2,2.35 21.2,7.25 20.5,7.95 19.66,7.95 v1(18.98,7.27) ; v1(19,63.25) 19,63.85 19.6,64.45 21.5,64.45 23.4,62.55 23.4,50.4 22.5,49.5 v1(22.5,47.25) 23.83,47.25 25.4,45.68 25.4,42.77 v1(24.7,42.07) 22.98,40.35 9.6,40.35 v1(9.2,40.75)
+5V: length 38.5
  Top Layer w0.2: R58.1 3.46,47.55 v1(3.5,47.55) ; FPC7.3 FPC7.2
  Top Layer w0.3: C98.2 5.98,53.03 5.84,53.18
  Top Layer w0.4: U23.6 5.86,56.4 5.94,56.48 5.94,58.12 C96.2 5.68,59.63 C97.2 ; C98.2 5.98,50.02 5.56,49.6 U22.6
  Top Layer w0.5: C97.2 5.34,60.49 9.08,64.23 17.96,64.23
  Bottom Layer w0.2: 4.56,50.18 4.56,48.61 v1(3.5,47.55)
  Bottom Layer w0.5: v1(5.94,50.18) 4.56,50.18 4.56,50.89 3.64,51.81 3.64,54.28 v1(5.84,56.48)
GND: length 4.2
  Top Layer w0.2: 18.48,5.55 U21.7 ; 18.48,5.55 U21.10 ; 18.48,5.55 U21.17 18.98,5.05 U21.15
  vias: v1(1.4,37.85) v1(1.5,44.85) v1(1.74,59.48) v1(1.84,52.63) v1(2.04,58.18) v1(2.46,68.78) v1(2.97,51.97) v1(3.35,51.23) v1(3.7,12.05) v1(3.8,57.85) v1(4.2,61.35) v1(4.5,64.15) v1(4.8,70.55) v1(5.6,12.95) v1(5.74,48.98) v1(6.04,55.48) v1(7.6,4.35) v1(7.8,59.95) v1(8.2,43.35) v1(8.59,70.9) v1(8.76,66.75) v1(8.9,62.95) v1(8.84,51.08) v1(8.94,53.08) v1(9.24,53.98) v1(10.7,43.79) v1(10.8,52.55) v1(11.3,53.55) v1(12.1,2.05) v1(12.4,11.85) v1(12.6,5.15) v1(12.8,58.45) v1(13.2,55.75) v1(13.4,61.55) v1(13.9,72.55) v1(14.74,6.05) v1(14.9,41.05) v1(15,45.35) v1(15.08,0.89) v1(15.4,66.85) v1(16.3,57.65) v1(16.3,52.65) v1(16.6,63.25) v1(16.8,65.25) v1(17,49.17) v1(18,12.75) v1(18.7,70.35) v1(19.2,60.95) v1(19.18,48.2) v1(19.27,45.42) v1(20,43.45) v1(20.07,42.32) v1(20.5,60.75) v1(20.8,39.65) v1(21.38,47.53) v1(21.43,1.2) v1(21.7,65.05) v1(22,58.15) v1(22,45.05) v1(22.1,62.55) v1(22.1,7.65) v1(22.88,4.39) v1(23.1,13.75) v1(23.3,49.15) v1(23.3,2.85) v1(24.1,72.55) v1(24.9,13.95) v1(25.1,39.15) v1(25.5,18.05) v1(25.6,22.85) v1(25.7,27.25) v1(25.9,60.45) v1(25.9,31.55) v1(26,67.08) v1(26.2,34.65) v1(27,5.25) v1(27.3,9.65)
A2: length 12.1
  Top Layer w0.2: v1(16.5,59.85) 17.15,60.5 FPC7.10
  Bottom Layer w0.2: v1(16.5,59.85) 13.87,62.47 7.25,62.47
AMP_SW: length 71.2
  Top Layer w0.2: v1(13.3,5.75) 13.3,3.3 15.2,3.3 15.3,3.2 ; 5.9,46.42 5.54,46.78 R58.2 ; 5.9,46.42 5.9,48.24 6.84,49.18 ; 5.9,46.42 5.9,38.05 0.8,32.95 0.8,11.19 5.14,6.85 v1(5.4,6.85) ; U23.1 7.76,55.1 6.84,54.18 6.84,49.18 ; U22.1 7.71,48.3 6.84,49.18
  Bottom Layer w0.2: v1(5.4,6.85) 9.4,6.85 10.5,5.75 v1(13.3,5.75)
BCK: length 18.1
  Top Layer w0.2: U20.13 17.82,47.25 15.7,47.25 15,47.95 15,56.65 15.6,57.25 15.6,59.85 16.75,61 FPC7.9
DACL: length 89.1
  Top Layer w0.2: v1(12.2,44.45) 12.2,44.46 C91.1 ; 23.58,45.97 22,45.97 v1(21.98,46) 21.84,46 v1(20.1,44.25) ; v1(9.8,12.55) 10.1,12.85 16.4,12.85 v1(16.7,12.55) ; R56.1 25,11.58 v1(25,12.75)
  Bottom Layer w0.2: v1(16.7,12.55) 16.7,9.55 17,9.25 19.5,9.25 20.25,10 20.25,11.5 21.7,12.95 24.8,12.95 v1(25,12.75) ; 13.98,44.25 12.4,44.25 v1(12.2,44.45) ; 13.98,44.25 13.98,41.93 13.4,41.35 8.3,41.35 1.6,34.65 1.6,12.72 5.28,9.05 7.2,9.05 8,9.85 8,11.95 8.6,12.55 v1(9.8,12.55) ; 13.98,44.25 v1(20.1,44.25)
DACR: length 117.2
  Top Layer w0.2: v1(10.2,9.05) 9.7,9.05 v1(8.7,10.05) ; v1(6.74,48.15) 6.74,46.71 8.9,44.55 v1(11.3,44.55) ; v1(11.3,11.95) 11.8,12.45 15.6,12.45 v1(15.8,12.25) ; v1(13.54,58.38) 13.54,57.63 C94.1 ; R57.1 23.43,11.62 v1(23.1,11.95) ; v1(21.38,46.7) 21.45,46.62 23.58,46.62
  Bottom Layer w0.2: 15.7,11.05 15.8,11.15 v1(15.8,12.25) ; 15.7,11.05 15.7,10.59 16.01,10.28 16.01,9.54 16.2,9.35 16.4,9.35 16.9,8.85 20,8.85 20.73,9.58 20.73,11.45 21.83,12.55 22.9,12.55 23.1,12.35 v1(23.1,11.95) ; 15.7,11.05 14.7,11.05 12.2,8.55 10.7,8.55 v1(10.2,9.05) ; v1(21.38,46.7) 21.38,45.22 20.9,44.75 14.3,44.75 13.3,45.75 12.1,45.75 11.3,44.95 v1(11.3,44.55) 11.3,44.32 11.74,43.88 13.07,43.88 13.4,43.55 13.4,41.95 13.2,41.75 8.1,41.75 1.2,34.85 1.2,12.55 5.1,8.65 7.3,8.65 v1(8.7,10.05) ; v1(6.74,48.15) 9.41,48.15 9.64,48.38 9.64,52.88 12.44,55.68 12.44,56.68 13.54,57.78 v1(13.54,58.38)
DIN: length 20.4
  Top Layer w0.2: FPC7.7 16.55,62 14.5,59.95 14.5,47.65 15.55,46.6 17.82,46.6 U20.14
J2-X: length 17.3
  Top Layer w0.2: v1(12.7,49.15) 12.7,43.2 12.2,42.7 12.2,41.4 STICK-R.4 ; FPC7.21 16.95,55 v1(16.7,54.75)
  Bottom Layer w0.2: v1(16.7,54.75) 12.7,50.75 v1(12.7,49.15)
J2-Y: length 17.5
  Top Layer w0.2: v1(13.3,52.25) 13.3,44.83 13.7,44.43 STICK-R.2 ; v1(16.1,55.05) 16.55,55.5 FPC7.20
  Bottom Layer w0.2: v1(13.3,52.25) v1(16.1,55.05)
K1: length 17.8
  Top Layer w0.2: FPC7.13 18.95,59 v1(19.4,59.45)
  Bottom Layer w0.2: v1(19.4,59.45) 11.4,51.45 11.4,48.92 9.72,47.25
K2: length 12.2
  Top Layer w0.2: v1(16.6,59.25) 16.85,59.5 FPC7.12
  Bottom Layer w0.2: 7.25,58.27 8.33,59.35 14.42,59.35 15.28,58.5 16.35,58.5 16.6,58.75 v1(16.6,59.25)
K3: length 20.9
  Top Layer w0.2: FPC7.11 19.45,60 v1(19.8,60.35)
  Bottom Layer w0.2: RT.2 22.25,69.1 19.8,66.65 17.1,66.65 14.99,64.54 14.99,63.66 16.2,62.45 18.7,62.45 19.8,61.35 v1(19.8,60.35)
L3: length 83
  Top Layer w0.2: v1(19.6,56.25) 19.35,56.5 FPC7.18 ; v1(16.3,8.45) 9.2,8.45 v1(8.6,9.05)
  Bottom Layer w0.2: 11.8,46.15 13.9,46.15 16.4,48.65 16.4,50.75 17.8,52.15 19.3,52.15 20,52.85 20,55.85 v1(19.6,56.25) ; 11.8,46.15 10.38,44.73 8.48,44.73 7.1,43.35 7.1,41.45 0.8,35.15 0.8,12.35 4.9,8.25 8,8.25 8.6,8.85 v1(8.6,9.05) ; 11.8,46.15 12.25,46.15 ; v1(16.3,8.45) 20.8,8.45 22.25,9.9 22.25,11.03
L+: length 2.7
  Top Layer w0.3: SPKR_L.1 2.6,49.12 3.41,48.3 U22.8
L-: length 2
  Top Layer w0.3: SPKR_L.2 4.35,50.4 U22.5
LRCK: length 20.9
  Top Layer w0.2: v1(15,57.75) 15,59.85 16.65,61.5 FPC7.8 ; U20.15 16.4,45.97 16.38,46 15.45,46 14,47.45 v1(14,56.45)
  Bottom Layer w0.2: v1(14,56.45) 14,56.75 v1(15,57.75)
P1: length 3.4
  Top Layer w0.2: v1(19.4,57.15) 19.05,57.5 FPC7.16
  Bottom Layer w0.2: v1(19.4,57.15) 20.52,58.27 20.75,58.27
P2: length 9.4
  Top Layer w0.2: FPC7.15 17.05,58 v1(16.1,58.95)
  Bottom Layer w0.2: v1(16.1,58.95) 14.3,60.75 9.72,60.75
P3: length 30.8
  Top Layer w0.2: RB.2 9.9,70.9 9.9,66.55 10.7,65.75 16.4,65.75 18.8,68.15 21.75,68.15 22.8,67.1 22.8,62.15 19.15,58.5 FPC7.14
PWR_BUTTON: length 9
  Top Layer w0.2: v1(22.3,64.55) 20.25,62.5 FPC7.6
  Bottom Layer w0.2: 25.25,62.47 23.18,64.55 v1(22.3,64.55)
R3: length 70.2
  Top Layer w0.2: v1(19.2,55.75) 18.95,56 FPC7.19
  Bottom Layer w0.2: 10.15,11.03 9.44,10.32 9.44,8.56 8.73,7.85 4.7,7.85 0.4,12.15 0.4,35.25 6.7,41.55 6.7,43.55 8.26,45.11 10.26,45.11 11.7,46.55 13.7,46.55 16,48.85 16,51.05 17.5,52.55 19.1,52.55 19.6,53.05 19.6,55.35 v1(19.2,55.75)
R+: length 1.9
  Top Layer w0.3: U23.8 4.34,54.95 SPKR_R.1
R-: length 2.6
  Top Layer w0.3: U23.5 3.51,57.05 2.7,56.24 SPKR_R.2
$1N5344: length 1.8
  Top Layer w0.2: 25.4,44.67 23.59,44.67 23.58,44.67
$1N5349: length 1.9
  Top Layer w0.2: 25.4,43.27 25.3,43.37 23.58,43.37
$1N5350: length 2.3
  Top Layer w0.2: 23.58,45.32 24.25,45.32 25.4,46.47
$1N5352: length 13.4
  Top Layer w0.2: U20.18 18.81,44.02 20.3,45.51 20.3,50.17 ; C79.1 17,51.25 20.15,51.25 20.5,50.9 20.5,50.17
$1N5360: length 4.8
  Top Layer w0.2: 21.38,10.05 22.6,8.82 R57.2 24.48,7.77 C83.2
$1N5361: length 10.1
  Top Layer w0.2: 21.38,12.05 22.38,11.05 22.38,10.09 22.58,9.89 24.69,9.89 R56.2 25.46,6.28 C82.2
$1N5362: length 3
  Top Layer w0.2: 20.14,5.05 22.83,5.05 C82.1
$1N5365: length 1.4
  Top Layer w0.2: 20.14,6.05 20.18,6.05 21.14,7.02
$1N5368: length 3.4
  Top Layer w0.2: U21.12 17.32,1.53 C87.1
$1N5369: length 1.5
  Top Layer w0.2: C88.2 16.1,5.35 16.4,5.05 U21.11
$1N5370: length 1.5
  Top Layer w0.2: U21.9 16.62,6.75 16.1,6.75
$1N5382: length 1.7
  Top Layer w0.2: U21.8 17.98,8.3 18.03,8.35
$1N9109: length 14.5
  Top Layer w0.4: v1(20,7.17) 19.94,7.17 U21.5
  Top Layer w0.5: CN13.3 7.75,6.25 12.7,6.25 14.1,7.65 v1(16.9,7.65)
  Bottom Layer w0.5: v1(20,7.17) 19.33,6.5 18.05,6.5 v1(16.9,7.65)
$1N9136: length 19.5
  Top Layer w0.4: U21.16 20.12,3.25 v1(20.3,3.25)
  Top Layer w0.5: CN13.5 8.85,11.15 14.75,11.15 CN13.4 15.5,10.4 v1(15.5,9.15)
  Bottom Layer w0.5: v1(15.5,9.15) 15.5,8.05 17.8,5.75 18.8,5.75 20.3,4.25 v1(20.3,3.25)
$1N24333: length 3.5
  Top Layer w0.2: C83.1 21.63,5.55 20.14,5.55
$1N24340: length 1.4
  Top Layer w0.2: 20.14,4.55 20.94,4.55 C84.1
$1N24601: length 4.2
  Top Layer w0.3: U22.2 7.86,48.95 7.54,49.28 7.54,51.68 C90.1
$1N24795: length 1.4
  Top Layer w0.2: 9.69,46.08 9.49,46.29 9.49,47.38
$1N24871: length 1.9
  Top Layer w0.2: C92.2 10.64,50.43 R64.1
$1N24873: length 3.8
  Top Layer w0.2: U22.3 9.73,49.6 10.39,48.94 10.39,47.88 R63.2
$1N24877: length 3
  Top Layer w0.2: U22.4 9.91,50.25 R64.2
$1N24927: length 4.2
  Top Layer w0.3: U23.2 7.76,55.75 7.34,56.18 C93.1
$1N25083: length 2.3
  Top Layer w0.2: R62.2 9.86,58.13 U23.4
$1N25086: length 2.6
  Top Layer w0.2: U23.3 9.51,56.4 9.94,55.98 9.94,55.73 R61.2
$1N25088: length 1.6
  Top Layer w0.2: R62.1 11.95,59.63 12.14,59.82
$1N25090: length 1.9
  Top Layer w0.2: C94.2 11.35,56.53 R61.1

## Copper pours and planes (outline as drawn; the poured copper is in the pictures)
+3.3V on Top Layer: 18.5,42.97 18.74,42.73 18.74,40.45 18.46,40.17 16.76,40.17 16.6,40.33 16.6,42.87 16.7,42.97
+3.3V on Top Layer: 25.31,42.17 24.51,42.97 22.7,42.97 22.6,42.87 22.6,40.27 22.9,39.97 24.66,39.97 24.95,40.27 24.95,40.82 25.1,40.97 25.82,40.97 25.92,41.07 25.92,42.05 25.8,42.17
GND on Top Layer: -6.8,85.05 31.3,85.05 31.3,-7.65 -6.8,-7.65
GND on Bottom Layer: -2.9,84.85 30.6,84.85 30.6,-2.45 -2.9,-2.45
GND on Inner1: -12.7,81.95 35.6,81.95 35.6,-15.65 -12.7,-15.65
GND on Inner2: -16.1,88.55 38.3,88.55 38.3,-13.25 -16.1,-13.25

## Text on the board
Top Silkscreen Layer: Pirate / Everything | L
